# Altium project BB8_Flywheel_Motors.PrjPcb
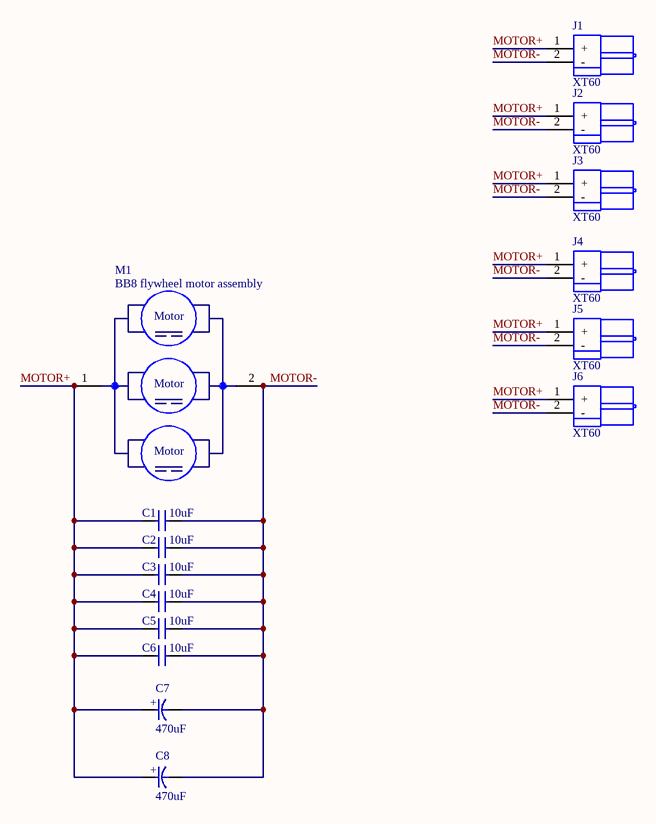
[diagram p0: BB8_Flywheel_Motors.SchDoc]
1 sheet, 15 parts. Net scope: global (net labels, ports and power ports of the same name join across sheets).
Board files: BB8_Flywheel_Motors.PcbDoc, BB8_Flywheel_Motors_Panel.PcbDoc

## Sheet BB8_Flywheel_Motors.SchDoc
size A4

### Parts
C1  value 10uF  [1210_Capacitor]  (hidden comment: C_1210_10uF)
C2  value 10uF  [1210_Capacitor]  (hidden comment: C_1210_10uF)
C3  value 10uF  [1210_Capacitor]  (hidden comment: C_1210_10uF)
C4  value 10uF  [1210_Capacitor]  (hidden comment: C_1210_10uF)
C5  value 10uF  [1210_Capacitor]  (hidden comment: C_1210_10uF)
C6  value 10uF  [1210_Capacitor]  (hidden comment: C_1210_10uF)
C7  value 470uF  [CAP_RADIAL_10x21.5mm_THRU]  (hidden comment: EKMG500ETD471MJ20S)
C8  value 470uF  [CAP_RADIAL_10x21.5mm_THRU]  (hidden comment: EKMG500ETD471MJ20S)
J1  XT60  [J_XT60_SMD_RA_Male]
J2  XT60  [J_XT60_SMD_RA_Male]
J3  XT60  [J_XT60_SMD_RA_Male]
J4  XT60  [J_XT60_SMD_RA_Male]
J5  XT60  [J_XT60_SMD_RA_Male]
J6  XT60  [J_XT60_SMD_RA_Male]
M1  BB8 flywheel motor assembly  [BB8_Flywheel_Motors_DC_36mm]

### Nets
MOTOR+: C1.2 C2.2 C3.2 C4.2 C5.2 C6.2 C7.1 C8.1 J1.1(+) J2.1(+) J3.1(+) J4.1(+) J5.1(+) J6.1(+) M1.1
MOTOR-: C1.1 C2.1 C3.1 C4.1 C5.1 C6.1 C7.2 C8.2 J1.2(-) J2.2(-) J3.2(-) J4.2(-) J5.2(-) J6.2(-) M1.2

### Notes on the sheet
- (in symbol BB8_Flywheel_Motors) Motor
- (in symbol C_EKMG500ETD471MJ20S) +

### Library data of the parts
C1-C6 = C_1210_10uF: CAP CER 10UF 50V 10% X5R 1210; Manufacturer: Taiyo Yuden; Manufacturer PN: UMK325BJ106KM-T; SVP Creator: Matt Rogge; Package: 1210; Supplier 1: Digi-Key; Supplier Part Number 1: 587-2247-1-ND
C7 C8 = C_EKMG500ETD471MJ20S: 470µF 50V Aluminum Capacitors Radial, Can 1000 Hrs @ 105°C; Supplier 1: Digi-Key; Supplier Part Number 1: 565-3745-1-ND
J1-J6 = J_XT60: 60 Amp XT60 Connector
M1 = BB8_Flywheel_Motors